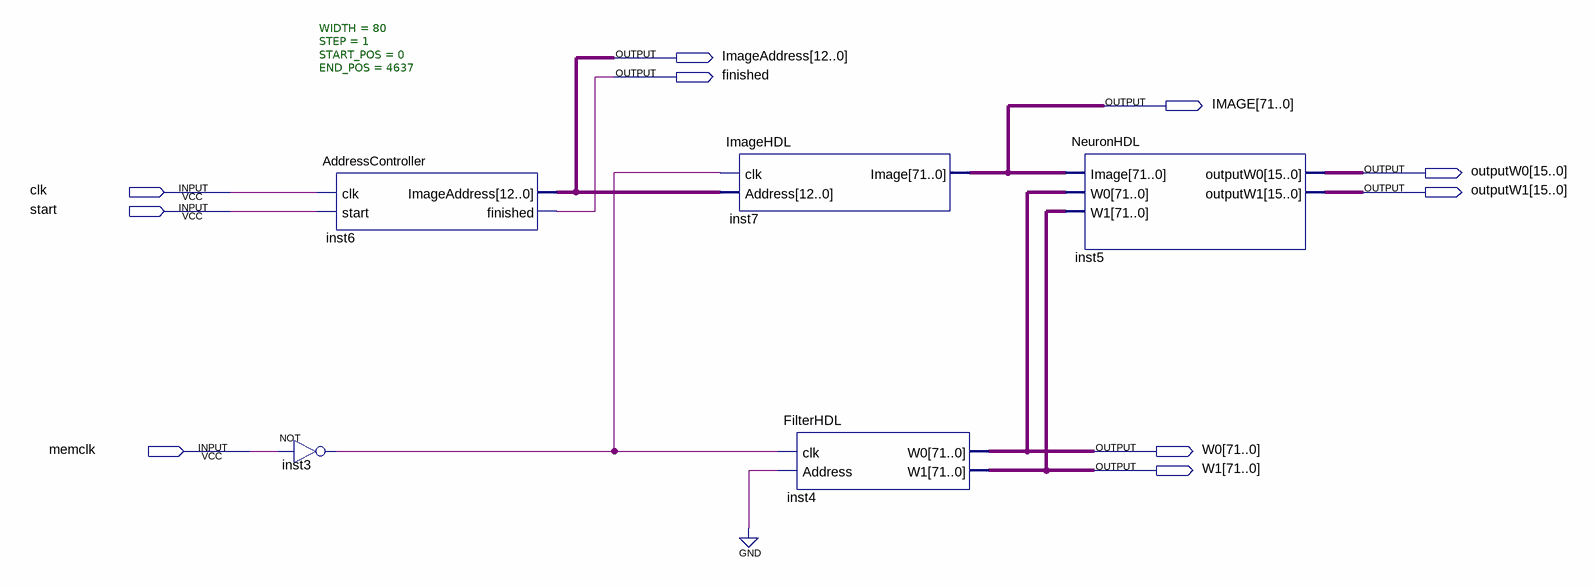
[diagram p0: schematic sheet]
// Quartus schematic CNN_LayerHDL.bdf as structural Verilog: 5 symbols, 10 pins
module CNN_LayerHDL (
  input  clk,
  input  start,
  input  memclk,
  output [12:0] ImageAddress,
  output finished,
  output [71:0] IMAGE,
  output [15:0] outputW0,
  output [15:0] outputW1,
  output [71:0] W0,
  output [71:0] W1
);

  wire inst3_out;

  AddressController #(.WIDTH(80), .STEP(1), .START_POS(0), .END_POS(4637)) inst6 (
    .clk(clk), .start(start), .ImageAddress(ImageAddress), .finished(finished));
  not inst3 (inst3_out, memclk);
  ImageHDL inst7 (.clk(inst3_out), .Address(ImageAddress), .Image(IMAGE));
  FilterHDL inst4 (.clk(inst3_out), .Address(1'b0), .W0(W0), .W1(W1));
  NeuronHDL inst5 (.Image(IMAGE), .W0(W0), .W1(W1), .outputW0(outputW0), .outputW1(outputW1));
endmodule
